# EAGLE design picade (EAGLE 6.4)
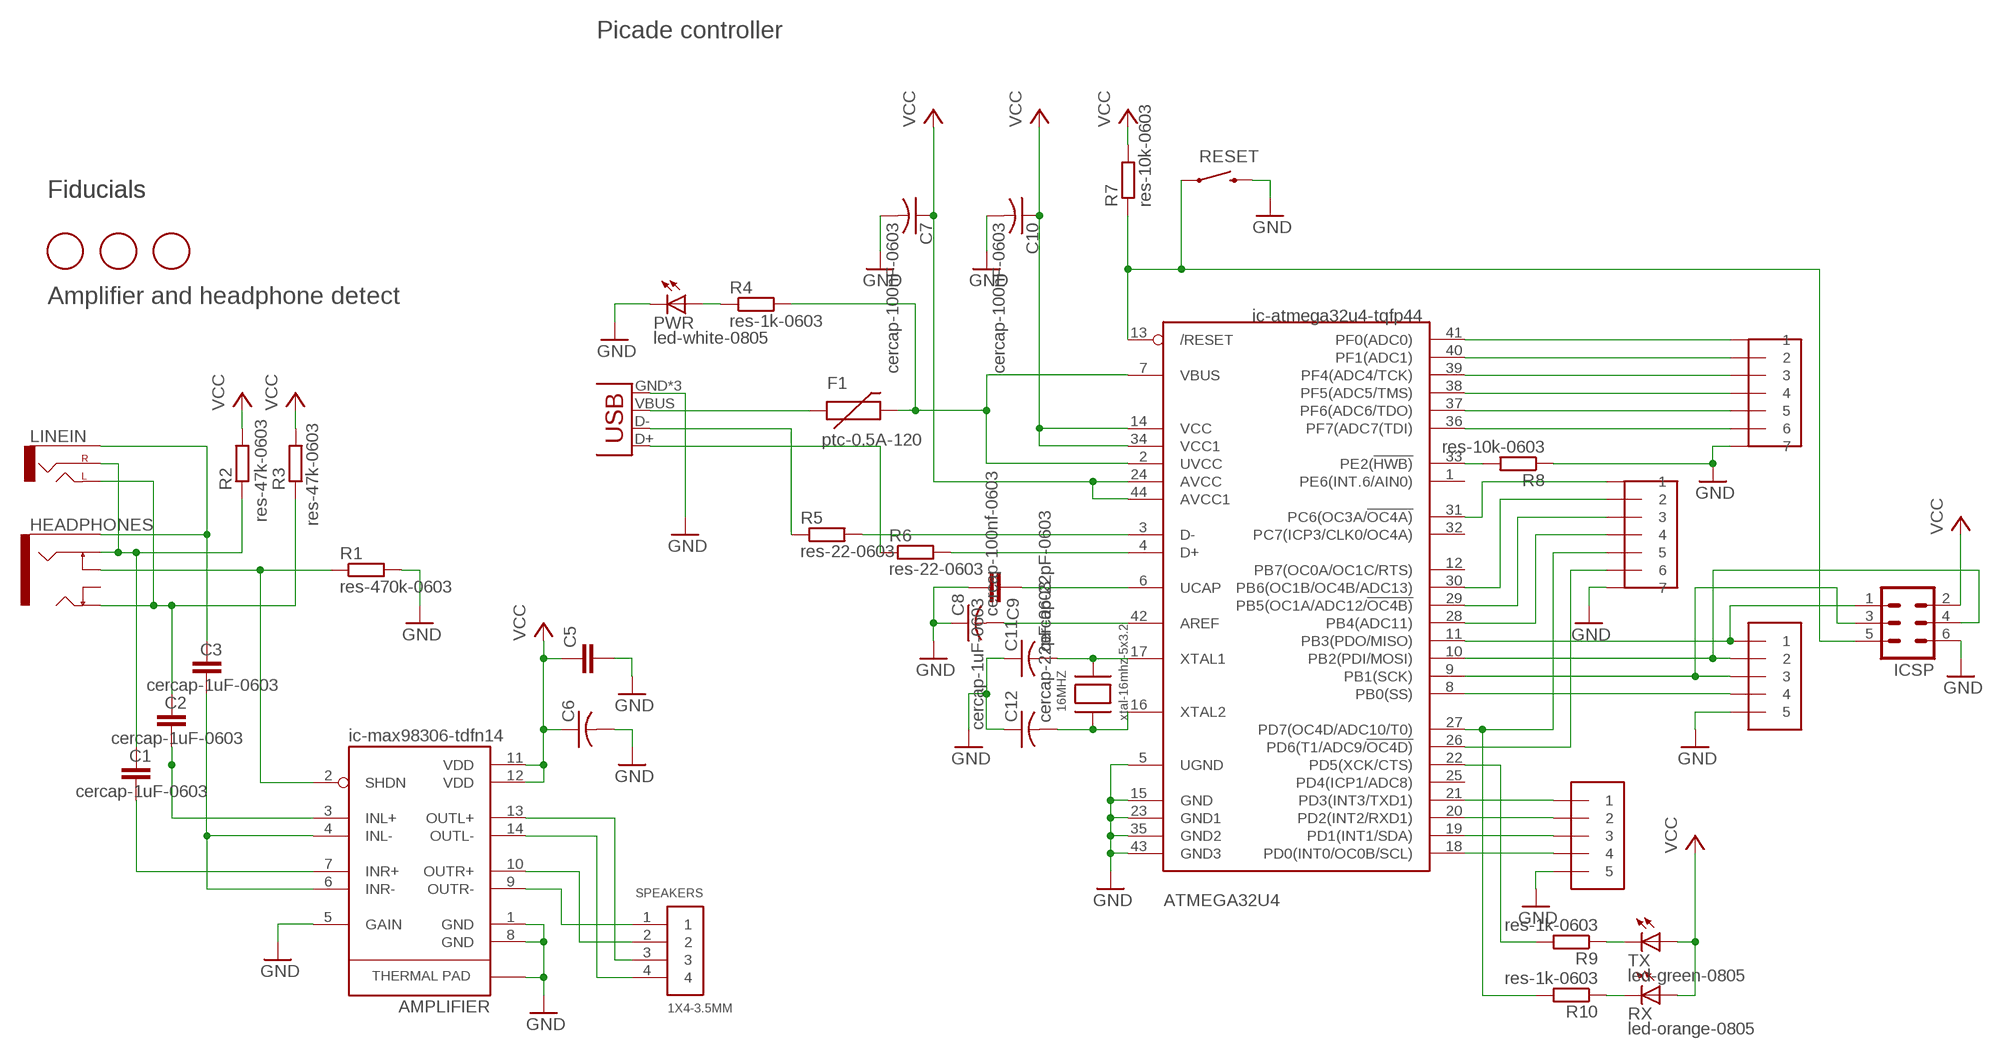
[diagram p0: schematic, sheet 1]

## Parts
16MHZ  xtal-16mhz-5x3.2  XTALNX5032  [NX5032]
AMPLIFIER  ic-max98306-tdfn14  MAX98306ETD+  [14-TDFN]
ATMEGA32U4  ic-atmega32u4-tqfp44  ATMEGA32U4-AU  [TQFP44]
BUTTONS  1X71X7  [1X07-3.5MM]
C1  cercap-1uF-0603  C-EUC0603K  [C0603K]
C2  cercap-1uF-0603  C-EUC0603K  [C0603K]
C3  cercap-1uF-0603  C-EUC0603K  [C0603K]
C5  cercap-10uF-0805  C-EUC0805K  [C0805K]
C6  cercap-100nF-0603  C-USC0603K  [C0603K]
C7  cercap-100nF-0603  C-USC0603K  [C0603K]
C8  cercap-100nf-0603  C-USC0603K  [C0603K]
C9  cercap-1uF-0603  C-EUC0603K  [C0603K]
C10  cercap-100nF-0603  C-USC0603K  [C0603K]
C11  cercap-22pF-0603  C-USC0603K  [C0603K]
C12  cercap-22pF-0603  C-USC0603K  [C0603K]
F1  ptc-0.5A-120  PTCSMD  [PTC-1206]
GPIO  1X71X7  [1X07-3.5MM]
HEADPHONES  stereo-jack-switched  AUDIO-JACK2SMD  [AUDIO-JACK-3.5MM-SMD]
ICSP  MA03-2  [MA03-2]
JOYSTICK  1X5  [1X05-3.5MM]
LINEIN  stereo-jack-noswitch  AUDIO-JACKSMD2  [AUDIO-JACK-3.5MM-SMD]
PWR  led-white-0805  LEDCHIPLED_0805  [CHIPLED_0805]
R1  res-470k-0603  R-EU_R0603  [R0603]
R2  res-47k-0603  R-EU_R0603  [R0603]
R3  res-47k-0603  R-EU_R0603  [R0603]
R4  res-1k-0603  R-EU_R0603  [R0603]
R5  res-22-0603  R-EU_R0603  [R0603]
R6  res-22-0603  R-EU_R0603  [R0603]
R7  res-10k-0603  R-EU_R0603  [R0603]
R8  res-10k-0603  R-EU_R0603  [R0603]
R9  res-1k-0603  R-EU_R0603  [R0603]
R10  res-1k-0603  R-EU_R0603  [R0603]
RESET  gullwing-switch  SWITCH-MOMENTARY-2-SMD-1101NE  [TACTILE-SWITCH-1101NE]
RX  led-orange-0805  LEDCHIPLED_0805  [CHIPLED_0805]
SPEAKERS  1X4-3.5MM  [1X04-3.5MM]
TX  led-green-0805  LEDCHIPLED_0805  [CHIPLED_0805]
U$1  FIDUCIAL  [FIDUCIAL_1MM]
U$2  FIDUCIAL  [FIDUCIAL_1MM]
U$3  FIDUCIAL  [FIDUCIAL_1MM]
USB  USB-REVERSE-MICROB  [USB-MICROB]
UTILITY  1X5  [1X05-3.5MM]

## Nets
GND: AMPLIFIER.1(GND) AMPLIFIER.5(GAIN) AMPLIFIER.8(GND) AMPLIFIER.15(GND) ATMEGA32U4.5(UGND) ATMEGA32U4.15(GND) ATMEGA32U4.23(GND1) ATMEGA32U4.35(GND2) ATMEGA32U4.43(GND3) BUTTONS.7 C5.2 C6.2 C7.2 C8.1 C9.2 C10.2 C11.1 C12.1 GPIO.7 ICSP.6 JOYSTICK.5 PWR.C R1.2 R8.1 RESET.P$2 USB.GND USB.MT1(GND) USB.MT2(GND) UTILITY.5
N$1: 16MHZ.P$2 ATMEGA32U4.17(XTAL1) C11.2
N$2: ATMEGA32U4.3(D-) R5.2
N$3: R5.1 USB.D-
N$4: R6.1 USB.D+
N$5: ATMEGA32U4.4(D+) R6.2
N$6: ATMEGA32U4.6(UCAP) C9.1
N$7: ATMEGA32U4.42(AREF) C8.2
N$8: 16MHZ.P$1 ATMEGA32U4.16(XTAL2) C12.2
N$9: PWR.A R4.1
N$10: ATMEGA32U4.22(PD5(XCK/CTS)) R9.2
N$11: R9.1 TX.C
N$12: R10.1 RX.C
N$13: ATMEGA32U4.27(PD7(OC4D/ADC10/T0)) GPIO.5 R10.2
N$14: ATMEGA32U4.11(PB3(PDO/MISO)) ICSP.1 JOYSTICK.1
N$15: F1.1 USB.VBUS
N$16: ATMEGA32U4.9(PB1(SCK)) ICSP.3 JOYSTICK.3
N$17: C3.1 HEADPHONES.SLEEVE LINEIN.SLEEVE
N$18: ATMEGA32U4.41(PF0(ADC0)) BUTTONS.1
N$19: ATMEGA32U4.40(PF1(ADC1)) BUTTONS.2
N$20: ATMEGA32U4.39(PF4(ADC4/TCK)) BUTTONS.3
N$21: ATMEGA32U4.38(PF5(ADC5/TMS)) BUTTONS.4
N$22: ATMEGA32U4.37(PF6(ADC6/TDO)) BUTTONS.5
N$23: ATMEGA32U4.36(PF7(ADC7(TDI)) BUTTONS.6
N$24: ATMEGA32U4.21(PD3(INT3/TXD1)) UTILITY.1
N$25: ATMEGA32U4.20(PD2(INT2/RXD1)) UTILITY.2
N$26: ATMEGA32U4.19(PD1(INT1/SDA)) UTILITY.3
N$27: ATMEGA32U4.18(PD0(INT0/OC0B/SCL)) UTILITY.4
N$28: ATMEGA32U4.8(PB0(SS)) JOYSTICK.4
N$29: ATMEGA32U4.29(PB5(OC1A/ADC12/!OC4B)) GPIO.3
N$30: ATMEGA32U4.30(PB6(OC1B/OC4B/ADC13)) GPIO.2
N$31: ATMEGA32U4.31(PC6(OC3A/!OC4A)) GPIO.1
N$32: AMPLIFIER.4(INL-) AMPLIFIER.6(INR-) C3.2
N$33: ATMEGA32U4.26(PD6(T1/ADC9/!OC4D)) GPIO.6
N$34: ATMEGA32U4.28(PB4(ADC11)) GPIO.4
N$35: AMPLIFIER.3(INL+) C2.2
N$36: AMPLIFIER.7(INR+) C1.2
N$37: C1.1 HEADPHONES.RING LINEIN.RING(RIGHT) R2.1
N$38: C2.1 HEADPHONES.TIP LINEIN.TIP(LEFT) R3.1
N$39: ATMEGA32U4.10(PB2(PDI/MOSI)) ICSP.4 JOYSTICK.2
N$41: ATMEGA32U4.33(PE2(!HWB)) R8.2
N$42: AMPLIFIER.2(SHDN) HEADPHONES.RSH R1.1
OUTL+: AMPLIFIER.13(OUTL+) SPEAKERS.3
OUTL-: AMPLIFIER.14(OUTL-) SPEAKERS.4
OUTR+: AMPLIFIER.10(OUTR+) SPEAKERS.2
OUTR-: AMPLIFIER.9(OUTR-) SPEAKERS.1
RESET: ATMEGA32U4.13(/RESET) ICSP.5 R7.1 RESET.P$1
VCC: AMPLIFIER.11(VDD) AMPLIFIER.12(VDD) ATMEGA32U4.2(UVCC) ATMEGA32U4.7(VBUS) ATMEGA32U4.14(VCC) ATMEGA32U4.24(AVCC) ATMEGA32U4.34(VCC1) ATMEGA32U4.44(AVCC1) C5.1 C6.1 C7.1 C10.1 F1.2 ICSP.2 R2.2 R3.2 R4.2 R7.2 RX.A TX.A
Unconnected: ATMEGA32U4.1(PE6(INT.6/AIN0)) ATMEGA32U4.12(PB7(OC0A/OC1C/RTS)) ATMEGA32U4.25(PD4(ICP1/ADC8)) ATMEGA32U4.32(PC7(ICP3/CLK0/OC4A)) HEADPHONES.TSH

## Notes on the sheet
- Picade controller
- Fiducials | Fiducials
- Amplifier and headphone detect

## Library data of the parts
16MHZ = adafruit:XTAL: Low cost SMT crystals, no capacitors included http://www.ladyada.net/library/eagle
AMPLIFIER = SparkFun-PowerIC:MAX98306: Stereo 3.7W Class D Amplifier Datasheet: http://datasheets.maxim-ic.com/en/ds/MAX98306.pdf The MAX98306 stereo 3.7W Class D amplifier provides Class AB audio performance with Class D efficiency. This device offers five selectable gain settings (6dB, 9dB, 12dB, 15dB, and 18dB) set by a single gain-select input (GAIN). Active emissions limiting, edge-rate, and overshoot control circuitry combined with a filterless spread-spectrum modulation scheme (SSM) provide excellent EMI performance while eliminating the need for output filtering found in traditional Class D devices. These features reduce application component count. The IC's 2.0mA quiescent current with a 3.7V supply extends battery life in portable applications. The IC is available in a 14-pin TDFN (3mm x 3mm x 0.75mm) package specified over the extended -40NC to +85NC temperature range.
ATMEGA32U4 = adafruit:ATMEGA32U4: http://www.ladyada.net/library/eagle
BUTTONS GPIO = pimoroni:1X7
C1-C3 C5 C9 = resistor:C-EU: CAPACITOR, European symbol
C6-C8 C10-C12 = adafruit:C-US: CAPACITOR, American symbol
F1 = SparkFun-PowerIC:PTC: Resettable Fuse PTC Resettable Fuse. Spark Fun Electronics SKU : COM-08357
HEADPHONES = pimoroni:AUDIO-JACK2: Stereo audio jack with bypass switches.
ICSP = con-lstb:MA03-2: PIN HEADER; OC_FARNELL: unknown; OC_NEWARK: unknown
JOYSTICK UTILITY = adafruit:1X5
LINEIN = SparkFun-Connectors:AUDIO-JACK: 3.5mm Audio Jack Simple 3.5mm common PCB mount audio jack. SKU: PRT-08032
PWR RX TX = adafruit:LED: LED OSRAM: - CHIPLED LG R971, LG N971, LY N971, LG Q971, LY Q971, LO R971, LY R971 LH N974, LH R974 LS Q976, LO Q976, LY Q976 LO Q996 - Hyper CHIPLED LW Q18S LB Q993, LB Q99A, LB R99A - SideLED LS A670, LO A670, LY A670, LG A670, LP A670 LB A673, LV A673, LT A673, LW A673 LH A674 LY A675 LS A676, LA A676, LO A676, LY A676, LW A676 LS A679, LY A679, LG A679 - Hyper Micro SIDELED® LS Y876, LA Y876, LO Y876, LY Y876 LT Y87S - SmartLED LW L88C, LW L88S LB L89C, LB L89S, LG L890 LS L89K, LO L89K, LY L89K LS L896, LA L896, LO L896, LY L896 - TOPLED LS T670, LO T670, LY T670, LG T670, LP T670 LSG T670, LSP T670, LSY T670, LOP T670, LYG T670 LG T671, LOG T671, LSG T671 LB T673, LV T673, LT T673, LW T673 LH T674 LS T676, LA T676, LO T676, LY T676, LB T676, LH T676, LSB T676, LW T676 LB T67C, LV T67C, LT T67C, LS T67K, LO T67K, LY T67K, LW E67C LS E67B, LA E67B, LO E67B, LY E67B, LB E67C, LV E67C, LT E67C LW T67C LS T679, LY T679, LG T679 LS T770, LO T770, LY T770, LG T770, LP T770 LB T773, LV T773, LT T773, LW T773 LH T774 LS E675, LA E675, LY E675, LS T675 LS T776, LA T776, LO T776, LY T776, LB T776 LHGB T686 LT T68C, LB T68C - Hyper Mini TOPLED® LB M676 - Mini TOPLED Santana® LG M470 LS M47K, LO M47K, LY M47K Source: http://www.osram.convergy.de/
R1-R10 = resistor:R-EU_: RESISTOR, European symbol
RESET = SparkFun-Electromechanical:SWITCH-MOMENTARY-2: Various NO switches- pushbuttons, reed, etc
SPEAKERS = adafruit:1X4: 4-pin connector
U$1-U$3 = adafruit:FIDUCIAL: For use by pick and place machines to calibrate the vision/machine, 1mm By microbuilder.eu
USB = pimoroni:USB-REVERSE: USB Connectors USB-B-PTH is fully proven SKU : PRT-00139/CONN-08278 USB-miniB is fully proven SKU : PRT-00587 USB-A-PCB is untested. USB-A-H is throughly reviewed, but untested. Spark Fun Electronics SKU : PRT-00437 USB-B-SMT is throughly reviewed, but untested. Needs silkscreen touching up. USB-A-S has not been used/tested USB-MB-H has not been used/tested USB-MICROB has been used. CONN-09505; PROD_ID: CONN-09505

## Board
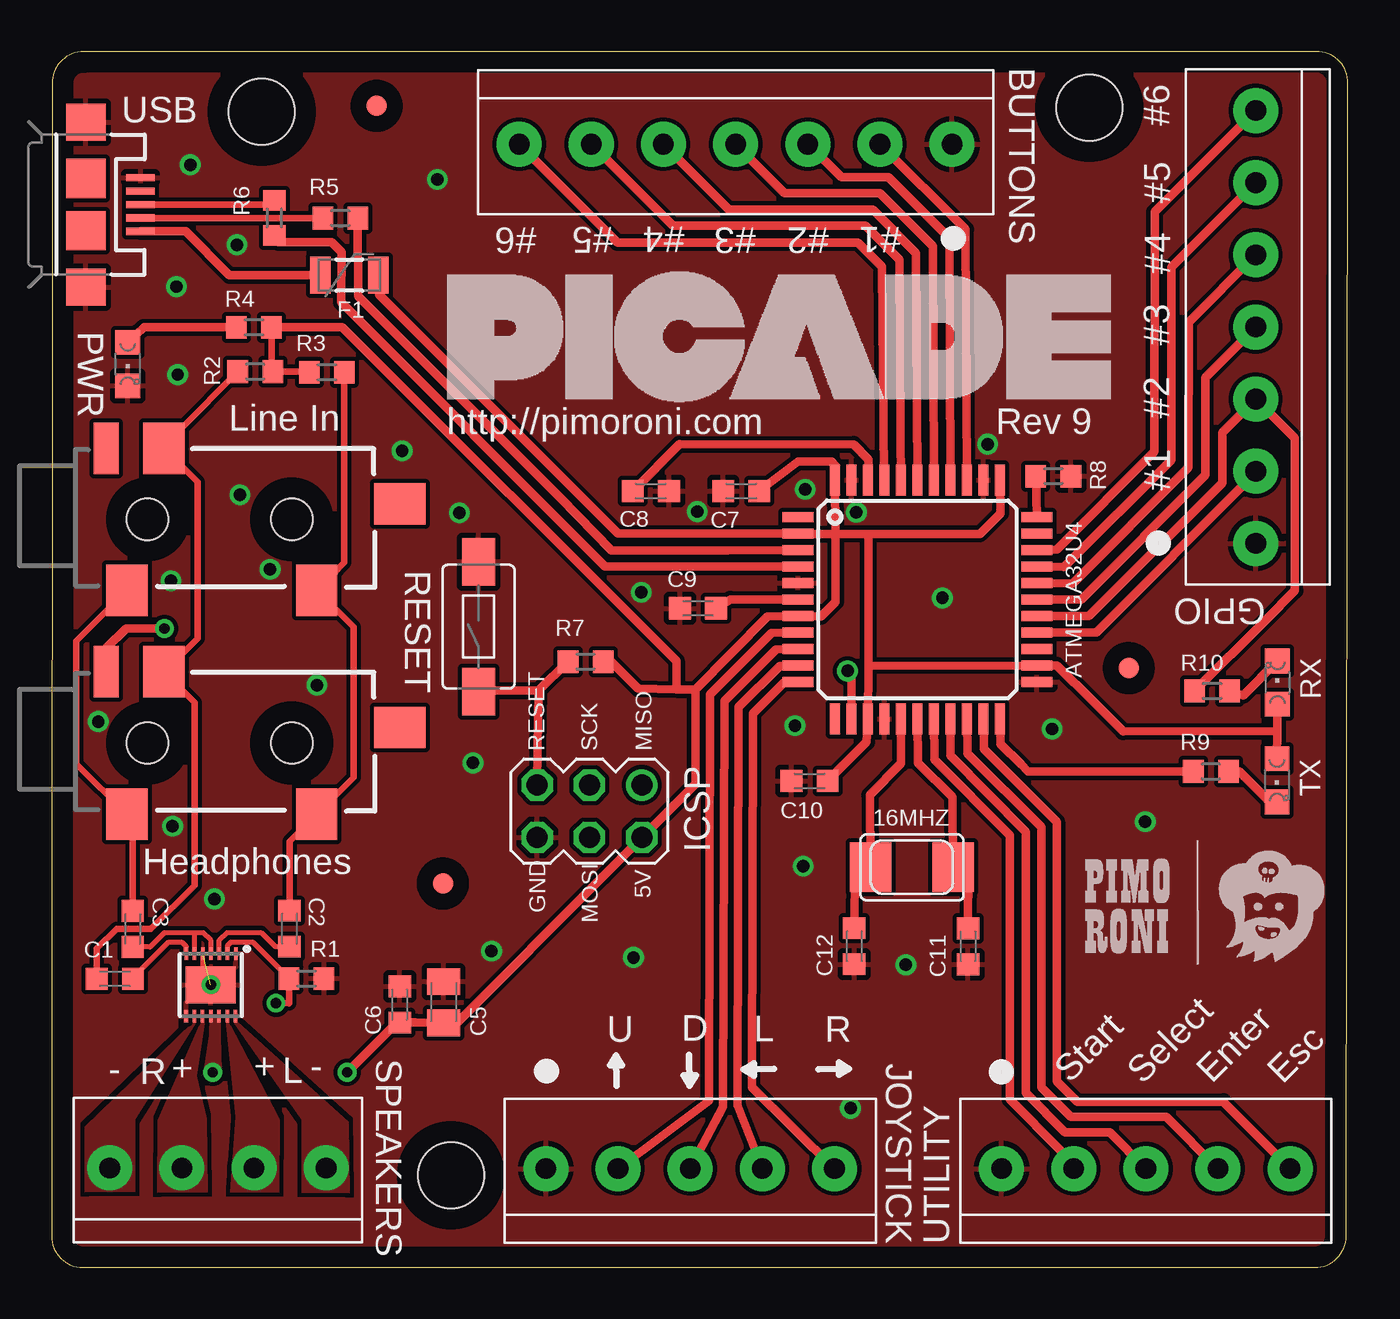
[diagram p1: board, top side]
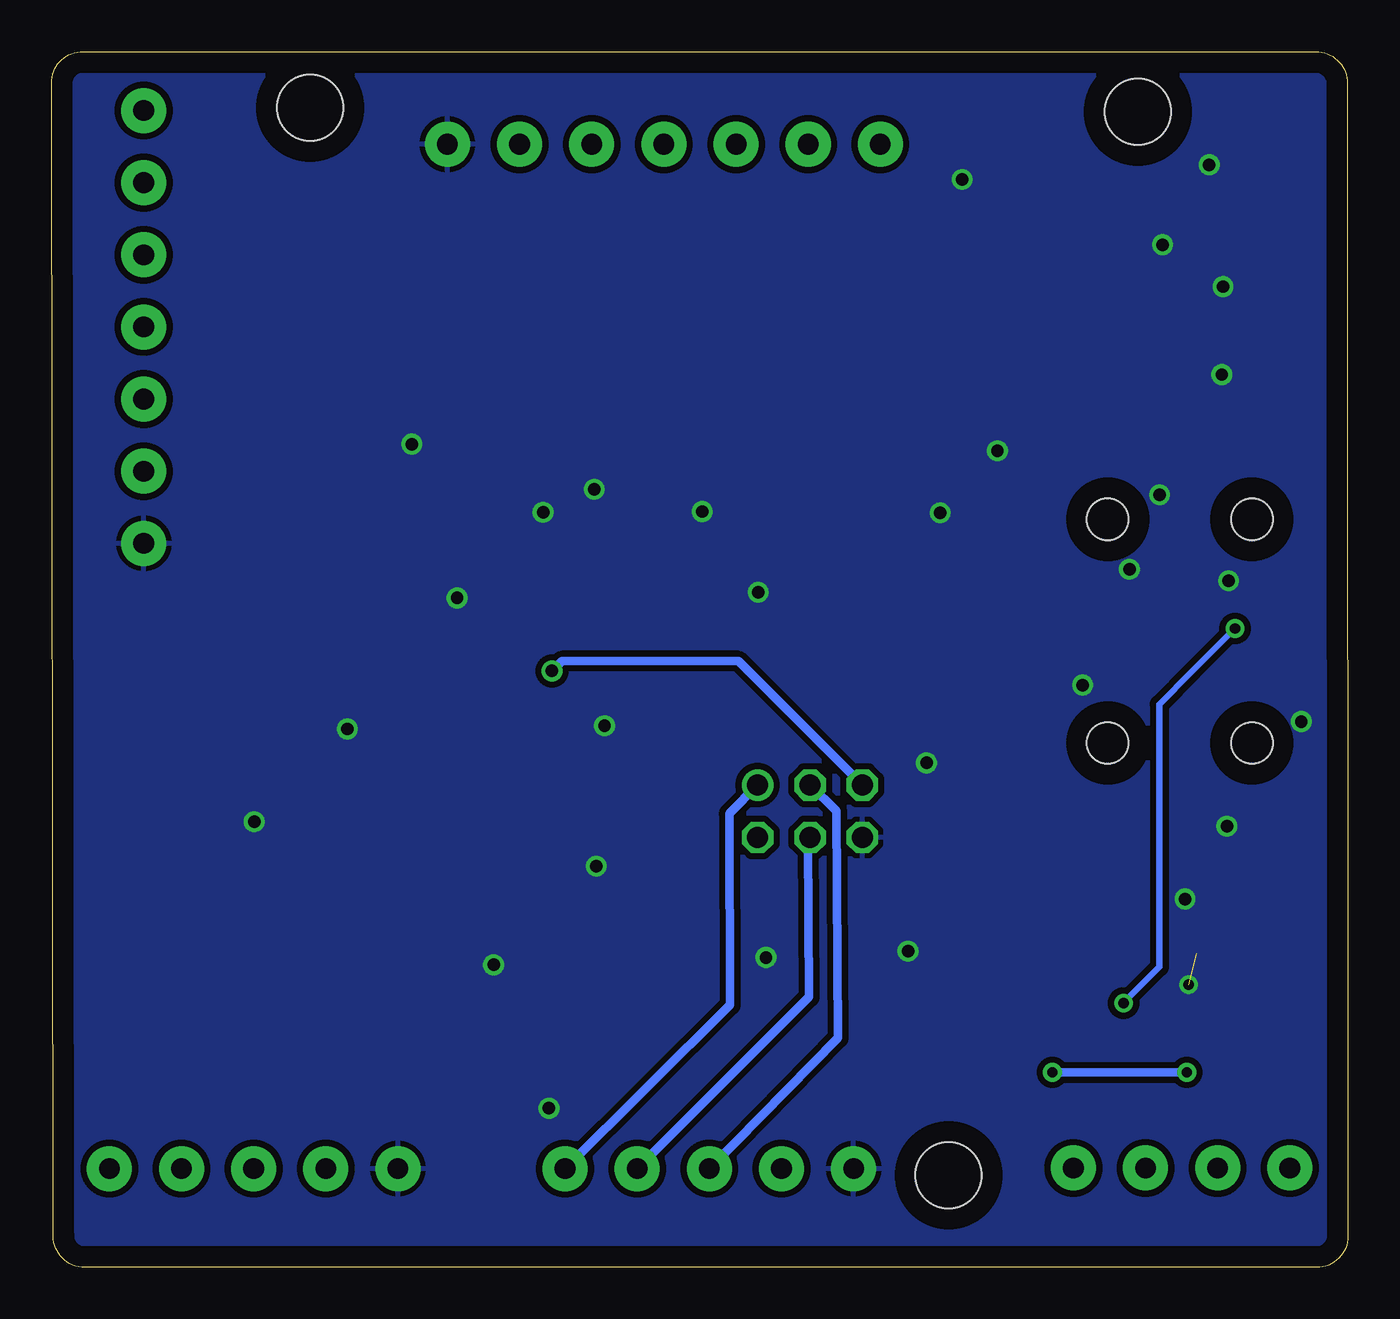
[diagram p2: board, bottom side, seen from below]

Size 62.89 x 58.99 mm. Coordinates in mm from the lower left corner, seen from the top.
Outline: 61.37,58.99 1.55,58.98 arc90 0.03,57.45 0,1.52 arc90 1.52,0 61.28,0 arc90 62.81,1.52 62.89,57.47 arc90 61.37,58.99
Copper layers (1*16): Top 0.035mm / dielectric 1.5mm / Bottom 0.035mm
Design rules "default *": minimum track width 8mil, minimum drill 24mil, track to track 8mil, track to pad 8mil, pad to pad 8mil, via to via 8mil, smd to smd 8mil, copper to edge 40mil, drill to drill 8mil, minimum pad ring 10mil, minimum via ring 8mil, stop-mask expansion 4mil, vias tented up to drill 25mil, thermal gap 10mil
Holes 3.2 mm at 50.35,56.25 19.37,4.46 10.19,56.08

### Footprints (pad centres in the part's own frame; a part is rotated, then mirrored left to right if it is on the bottom)
NX5032 = smd 2 x 2.4: P$1 2,0; P$2 -2,0
14-TDFN = smd 0.6 x 0.229: 1 -1.519,1.208; 2 -1.519,0.808; 3 -1.519,0.408; 4 -1.519,0.008; 5 -1.519,-0.392; 6 -1.519,-0.792; 7 -1.519,-1.192; 8 1.512,-1.195; 9 1.512,-0.795; 10 1.512,-0.395; 11 1.512,0.005; 12 1.512,0.405; 13 1.512,0.805; 14 1.512,1.205 | smd 1.778 x 2.413: 15 0,0
TQFP44 = smd 1.5 x 0.5: 1 -5.8,4; 2 -5.8,3.2; 3 -5.8,2.4; 4 -5.8,1.6; 5 -5.8,0.8; 6 -5.8,0; 7 -5.8,-0.8; 8 -5.8,-1.6; 9 -5.8,-2.4; 10 -5.8,-3.2; 11 -5.8,-4; 23 5.8,-4; 24 5.8,-3.2; 25 5.8,-2.4; 26 5.8,-1.6; 27 5.8,-0.8; 28 5.8,0; 29 5.8,0.8; 30 5.8,1.6; 31 5.8,2.4; 32 5.8,3.2; 33 5.8,4 | smd 0.5 x 1.5: 12 -4,-5.8; 13 -3.2,-5.8; 14 -2.4,-5.8; 15 -1.6,-5.8; 16 -0.8,-5.8; 17 0,-5.8; 18 0.8,-5.8; 19 1.6,-5.8; 20 2.4,-5.8; 21 3.2,-5.8; 22 4,-5.8; 34 4,5.8; 35 3.2,5.8; 36 2.4,5.8; 37 1.6,5.8; 38 0.8,5.8; 39 0,5.8; 40 -0.8,5.8; 41 -1.6,5.8; 42 -2.4,5.8; 43 -3.2,5.8; 44 -4,5.8
1X07-3.5MM = drill 1 pad 2.184: 1 10.5,0; 2 7,0; 3 3.5,0; 4 0,0; 5 -3.5,0; 6 -7,0; 7 -10.5,0
C0603K = smd 1.05 x 1.08: 1 -0.875,0; 2 0.875,0
C0805K = smd 1.3 x 1.6: 1 -1,0; 2 1,0
PTC-1206 = smd 1 x 1.8: 1 -1.4,0; 2 1.4,0
AUDIO-JACK-3.5MM-SMD = smd 2 x 2.5: RING 4.3,3.45; SLEEVE 2.5,-3.45; TIP 11.7,-3.45 | smd 1.2 x 2.5: RSH 1.5,3.45 | smd 2.5 x 2: TSH 15.75,0.75 | hole 2: 3.5,0; 10.5,0
MA03-2 = drill 1.016: 1 -2.54,-1.27 | drill 1.016 octagon: 2 -2.54,1.27; 3 0,-1.27; 4 0,1.27; 5 2.54,-1.27; 6 2.54,1.27
1X05-3.5MM = drill 1 pad 2.184: 1 7,0; 2 3.5,0; 3 0,0; 4 -3.5,0; 5 -7,0
CHIPLED_0805 = smd 1.2 x 1.2: A 0,-1.05; C 0,1.05
R0603 = smd 1 x 1.1: 1 -0.85,0; 2 0.85,0
TACTILE-SWITCH-1101NE = smd 2.3 x 1.6: P$1 -3.15,0; P$2 3.15,0
1X04-3.5MM = drill 1 pad 2.184: 1 -5.25,0; 2 -1.75,0; 3 1.75,0; 4 5.25,0
FIDUCIAL_1MM = smd 1 x 1: 1 0,0
USB-MICROB = smd 0.35 x 1.4: D+ 0,2.65; D- 0.65,2.65; GND -1.3,2.65; ID -0.65,2.65; VBUS 1.3,2.65 | smd 1.8 x 1.9: MT1 -4,0; MT2 4,0 | smd 1.9 x 1.9: P$1 -1.27,0; P$2 1.27,0

### Placement (x,y rotation side)
16MHZ  41.74,19.41 180 top
AMPLIFIER  7.73,13.7 270 top
ATMEGA32U4  42.01,32.4 0 top
BUTTONS  33.19,54.49 180 top
C1  3.07,14 0 top
C2  11.54,16.44 270 top
C3  3.94,16.42 270 top
C5  19.03,12.87 90 top
C6  16.9,12.76 90 top
C7  33.45,37.66 180 top
C8  29.08,37.66 180 top
C9  31.36,31.98 180 top
C10  36.77,23.6 180 top
C11  44.47,15.57 90 top
C12  38.95,15.58 90 top
F1  14.45,48.14 0 top
GPIO  58.42,45.63 90 top
HEADPHONES  1.16,25.44 0 top
ICSP  26.1,22.13 180 top
JOYSTICK  30.98,4.79 0 top
LINEIN  1.16,36.29 0 top
PWR  3.69,43.82 180 top
R1  12.37,14.01 0 top
R2  9.88,43.46 0 top
R3  13.35,43.42 180 top
R4  9.83,45.61 0 top
R5  14.01,50.9 0 top
R6  10.81,50.92 270 top
R7  25.91,29.39 0 top
R8  48.6,38.39 180 top
R9  56.24,24.06 180 top
R10  56.29,27.97 180 top
RESET  20.72,31.09 90 top
RX  59.47,28.37 0 top
SPEAKERS  8.07,4.83 0 top
TX  59.45,23.63 180 top
U$1  15.77,56.35 0 top
U$2  18.98,18.63 0 top
U$3  52.26,29.08 0 top
USB  1.67,51.56 270 top
UTILITY  53.09,4.79 0 top

### Tracks (layer width: path | path; a pad name or v marks a point on that pad's centre or on a via)
GND  (via drill 0.5, 0.6)  (1 unrouted)
  other vias: 7.73,13.71 6.06,47.58 20.45,24.48 28.61,32.76 45.41,39.94 31.32,36.67 21.34,15.34 36.47,19.47 36.07,26.28 48.54,26.12 43.22,32.48 38.76,7.72 8.99,49.61 6.73,53.49 41.44,14.68 5.87,21.41 12.87,28.25 7.91,17.87 2.26,26.48 6.12,43.31 10.6,33.87 17.01,39.61 36.57,37.75 9.14,37.48 19.78,36.6 28.23,15.04 53.06,21.63 18.71,52.79 39.04,36.63 5.8,33.31
  pour Top (isolate 0.203, rank 2): -0.06,59.09 62.97,59.54 63.08,0.23 18.12,0.01 -0.27,0.07
  pour Bottom (isolate 0.305, rank 2): -0.08,59.11 61.83,59.57 arc-90 63.1,56.88 62.88,0.1 18.03,0.07 -0.31,0.24
N$1
  Top 0.406: ATMEGA32U4.17 42.04,24.48 43.71,22.82 16MHZ.P$2 44.49,19.39 C11.2
N$2
  Top 0.406: R5.2 14.86,47.12 24.69,37.31 27.18,34.79 32.79,34.79 ATMEGA32U4.3
N$3
  Top 0.305: R5.1 11.97,50.9 USB.D-
N$4
  Top 0.305: 10.8,51.56 USB.D+
  Top 0.406: 10.8,51.56 R6.1
N$5
  Top 0.406: R6.2 11,49.74 13.58,49.74 14.07,49.24 14.06,46.82 26.86,34.01 32.44,34.01 ATMEGA32U4.4
N$6
  Top 0.406: C9.1 32.93,32.4 ATMEGA32U4.6
N$7
  Top 0.406: ATMEGA32U4.42 39.64,38.23 39.64,39.2 38.92,39.93 30.46,39.93 C8.2
N$8
  Top 0.406: ATMEGA32U4.16 41.22,24.44 39.7,22.91 16MHZ.P$1 38.98,19.35 C12.2
N$9
  Top 0.406: PWR.A 4.49,45.61 R4.1
N$10
  Top 0.406: ATMEGA32U4.22 46.04,25.38 47.04,24.39 47.37,24.07 R9.2
N$11
  Top 0.406: R9.1 57.63,24.05 59.11,22.59 TX.C
N$12
  Top 0.406: R10.1 57.81,27.75 RX.C
N$13
  Top 0.406: ATMEGA32U4.27 50.33,31.6 56.79,38.06 56.79,40.5 GPIO.5 60.32,40.23 60.32,32.84 58.91,31.42 R10.2
N$14
  Top 0.406: JOYSTICK.1 33.99,8.74 34.04,26.88 35.54,28.38 ATMEGA32U4.11
  Bottom 0.406: ICSP.1 30.01,22.02 29.97,12.73 JOYSTICK.1
N$15
  Top 0.406: USB.VBUS 6.5,50.26 8.63,48.13 F1.1
N$16
  Top 0.406: JOYSTICK.3 32.59,7.79 32.64,27.48 35.14,29.98 ATMEGA32U4.9
  Bottom 0.406: ICSP.3 24.81,22.14 24.74,11.13 JOYSTICK.3
N$17
  Top 0.305: LINEIN.SLEEVE 1.21,30.4 1.21,24.43 3.64,21.99 | 3.94,21.71 C3.1
  Top 0.406: 3.64,21.99 HEADPHONES.SLEEVE 3.94,21.71
N$18
  Top 0.406: ATMEGA32U4.41 40.44,38.23 40.37,38.36 40.29,48.55 39.13,49.7 27.45,49.72 BUTTONS.1
N$19
  Top 0.406: ATMEGA32U4.40 41.18,40.36 41.13,48.88 39.48,50.54 30.15,50.53 BUTTONS.2
N$20
  Top 0.406: ATMEGA32U4.39 41.94,49.21 39.86,51.32 32.86,51.32 BUTTONS.3
N$21
  Top 0.406: ATMEGA32U4.38 42.76,49.55 40.19,52.12 35.56,52.12 BUTTONS.4
N$22
  Top 0.406: ATMEGA32U4.37 43.57,49.92 40.61,52.88 38.32,52.88 BUTTONS.5
N$23
  Top 0.406: ATMEGA32U4.36 44.34,50.37 BUTTONS.6
N$24
  Top 0.406: ATMEGA32U4.21 45.24,25.14 48.77,21.62 48.77,9.02 49.78,8.03 56.85,8.04 UTILITY.1
N$25
  Top 0.406: ATMEGA32U4.20 44.44,24.94 48.02,21.37 48.01,8.75 49.45,7.31 54.08,7.31 UTILITY.2
N$26
  Top 0.406: ATMEGA32U4.19 43.62,24.84 47.26,21.13 47.26,8.48 49.16,6.55 51.34,6.54 UTILITY.3
N$27
  Top 0.406: ATMEGA32U4.18 42.84,24.64 46.49,20.96 46.49,8.14 48.93,5.68 UTILITY.4
N$28
  Top 0.406: JOYSTICK.4 31.89,8.08 31.94,27.78 34.94,30.78 ATMEGA32U4.8
N$29
  Top 0.406: ATMEGA32U4.29 49.54,33.18 55.16,38.79 55.17,45.87 GPIO.3
N$30
  Top 0.406: ATMEGA32U4.30 49.11,33.98 54.32,39.18 54.33,48.52 GPIO.2
N$31
  Top 0.406: ATMEGA32U4.31 48.76,34.82 53.51,39.57 53.52,51.21 GPIO.1
N$32
  Top 0.254: AMPLIFIER.4 7.74,15.86 7.36,16.24 6.94,16.24 | 6.94,16.24 5.47,16.24 4.77,15.55 C3.2 | AMPLIFIER.6 6.94,16.24
N$33
  Top 0.406: ATMEGA32U4.26 50.69,30.8 58.16,38.28 GPIO.6
N$34
  Top 0.406: ATMEGA32U4.28 49.95,32.41 55.98,38.44 55.98,43.17 GPIO.4
N$35
  Top 0.254: AMPLIFIER.3 8.14,15.88 8.51,16.25 10.17,16.25 10.85,15.57 C2.2
N$36
  Top 0.254: AMPLIFIER.7 6.54,15.57 6.34,15.76 5.65,15.76 3.9,13.99 C1.2
N$37
  Top 0.305: LINEIN.RING 7.09,38.11 7.09,30.51 HEADPHONES.RING 6.94,27.41 6.94,18.54 4.81,16.42 3.16,16.42 2.2,15.47 C1.1 | R2.1 6.23,40.65
  Top 0.406: LINEIN.RING 5.46,40.65 6.23,40.65
N$38
  Top 0.305: LINEIN.TIP 14.64,31.06 14.64,23.77 HEADPHONES.TIP | HEADPHONES.TIP 11.54,20.68 C2.1 | 13.68,33.67 14.2,34.19 R3.1
  Top 0.406: HEADPHONES.TIP | LINEIN.TIP 13.68,33.67
N$39
  Top 0.406: JOYSTICK.2 33.29,7.86 33.34,27.18 35.34,29.18 ATMEGA32U4.10
  Bottom 0.406: JOYSTICK.2 26.14,13.12 26.19,20.76 arc90 ICSP.4
N$41
  Top 0.406: ATMEGA32U4.33 R8.2
N$42  (via drill 0.5)
  Top 0.254: AMPLIFIER.2 8.53,15.62 8.7,15.79 9.76,15.79 R1.1
  Top 0.305: v10.89,12.82 11.53,12.82 R1.1
  Top 0.406: HEADPHONES.RSH 2.66,30.04 3.62,31 v5.48,30.99
  Bottom 0.305: v5.48,30.99 7.56,28.9 9.16,27.32 9.14,14.57 v10.89,12.82
OUTL+
  pour Top (no thermals): 8.42,12.23 8.94,7.32 8.67,3.65 11.05,3.64 11.06,7.19 8.62,11.88 8.6,12.29
OUTL-
  pour Top (no thermals): 8.84,12.29 8.82,11.92 12.13,7.17 12.13,3.61 14.45,3.6 14.42,7.06 9.03,11.91 9.04,12.29
OUTR+
  pour Top (no thermals): 7.24,12.29 7.21,11.84 5.14,7.15 5.13,3.63 7.57,3.64 7.52,7.24 7.04,9.28 7.44,11.85 7.44,12.29
OUTR-
  pour Top (no thermals): 6.84,12.29 6.82,11.87 1.6,6.82 1.6,3.65 4.05,3.66 4.05,7.18 7.05,11.91 7.04,12.29
RESET  (via drill 0.6)
  Top 0.406: v38.62,28.94 38.82,28.64 ATMEGA32U4.13 | R7.1 23.62,28 | 23.62,28 23.58,25.17 ICSP.5 | RESET.P$1 21.13,27.99 23.62,28
  Bottom 0.406: ICSP.5 29.57,29.42 38.14,29.42 v38.62,28.94
VCC  (via drill 0.5)
  Top 0.254: C6.1 16.76,11.88 | v7.82,9.47 7.83,9.48
  Top 0.305: R3.2 11.97,43.46 R2.2 10.68,44.17 R4.2
  Top 0.406: 38.04,35.58 ATMEGA32U4.44 38.03,38.14 38.03,38.89 37.86,39.1 36.21,39.1 C7.1 | ATMEGA32U4.34 46.04,36.58 45.04,35.58 39.64,35.58 | 39.64,35.58 38.04,35.58 | 39.64,29.18 ATMEGA32U4.24 48.77,29.21 50.54,27.46 51.99,25.99 59.46,26.03 | 39.64,29.18 ATMEGA32U4.14 39.54,25.48 C10.1 | 39.64,29.18 39.64,35.58 | 38.04,35.58 38.04,32.28 37.34,31.58 ATMEGA32U4.7 34.74,31.58 31.23,28.04 | 38.04,35.58 36.19,35.58 ATMEGA32U4.2 27.49,35.6 15.9,47.19 F1.2 | 31.23,28.04 31.23,23.46 ICSP.2 26.8,19.01 26.79,18.99 19.68,11.86 C5.1 17.67,11.89 C6.1 | R7.2 27.15,29.39 28.46,28.08 30.32,28.05 | 30.32,28.05 31.23,28.04 | R4.2 14.09,45.61 30.31,29.43 30.32,28.05 | RX.A 59.46,26.03 | 59.46,26.03 TX.A | 16.76,11.88 v14.34,9.47 | 7.83,9.48 7.83,9.56
  Bottom 0.406: v14.34,9.47 v7.82,9.47
  pour Top (no thermals): 7.68,12.18 7.65,11.26 7.42,9.82 7.37,9.49 7.52,9.28 7.78,9.17 8.15,9.27 8.26,9.53 8.2,11.24 8.2,12.1 8.19,12.1
(copper drawn outside any net)
  shapes: Top area x1

### Text on the board
tPlace: #6 | #5 | #6 | #5 | #4 | #3 | #2 | #1 | #4 | #3 | Line In | http://pimoroni.com | Rev 9 | #2 | #1 | RESET | SCK | MISO | Headphones | 5V | GND | MOSI | U | D | L | R | - | R | + | + | L | - | Start | Select | Enter | Esc